# EAGLE design laser (EAGLE 6.5.0)
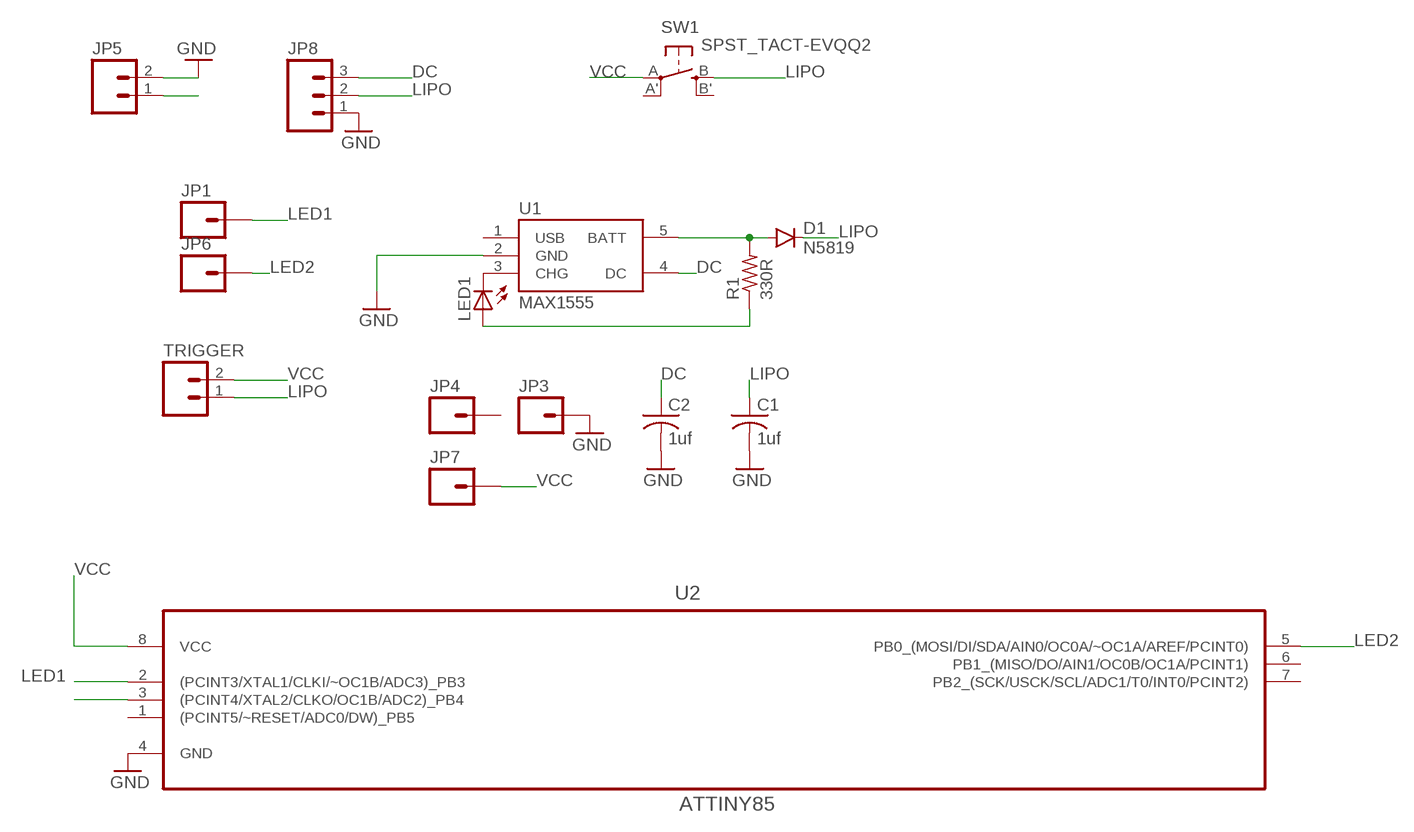
[diagram p0: schematic, sheet 1]

## Parts
C1  1uf  C-USC0805K  [C0805K]
C2  1uf  C-USC0805K  [C0805K]
D1  N5819  DIODE1N4148  [DIODE-1N4148]
JP1  M01PTH  [1X01]
JP3  M01PTH  [1X01]
JP4  M01PTH  [1X01]
JP5  M02LOCK  [1X02_LOCK]
JP6  M01PTH  [1X01]
JP7  M01PTH  [1X01]
JP8  M03LOCK  [1X03_LOCK]
LED1  LEDCHIP-LED0805  [CHIP-LED0805]
R1  330R  R-US_M0805  [M0805]
SW1  SPST_TACT-EVQQ2  [EVQ-Q2]
TRIGGER  M02PTH  [1X02]
U1  MAX1555  [SOT23-5]
U2  ATTINY85  ATTINY85-20PU  [DIP254P762X533-8]

## Nets
DC: C2.1 JP8.3 U1.4(DC)
GND: C1.2 C2.2 JP3.1 JP5.2 JP8.1 U1.2(GND) U2.4(GND)
LED1: JP1.1 U2.2((PCINT3/XTAL1/CLKI/~OC1B/ADC3)_PB3)
LED2: JP6.1 U2.5(PB0_(MOSI/DI/SDA/AIN0/OC0A/~OC1A/AREF/PCINT0))
LIPO: C1.1 D1.C JP8.2 SW1.B(S) TRIGGER.1
N$1: LED1.C U1.3(CHG)
N$3: D1.A R1.2 U1.5(BATT)
N$4: LED1.A R1.1
TONE: JP5.1 U2.3((PCINT4/XTAL2/CLKO/OC1B/ADC2)_PB4)
VCC: JP7.1 SW1.A(P) TRIGGER.2 U2.8(VCC)
Unconnected: JP4.1 SW1.A'(P1) SW1.B'(S1) U1.1(USB) U2.1((PCINT5/~RESET/ADC0/DW)_PB5) U2.6(PB1_(MISO/DO/AIN1/OC0B/OC1A/PCINT1)) U2.7(PB2_(SCK/USCK/SCL/ADC1/T0/INT0/PCINT2))

## Library data of the parts
C1 C2 = adafruit:C-US: CAPACITOR, American symbol
D1 = SparkFun-DiscreteSemi:DIODE: Diode These are standard reverse protection diodes and small signal diodes. SMA package can handle up to about 1A. SOD-323 can handle about 200mA. What the SOD-323 package when ordering, there are some mfgs out there that are 5-pin packages.
JP1 JP3 JP4 JP6 JP7 = SparkFun-Connectors:M01: Header 1 Standard 1-pin 0.1" header. Use with straight break away headers (SKU : PRT-00116), right angle break away headers (PRT-00553), swiss pins (PRT-00743), machine pins (PRT-00117), and female headers (PRT-00115).
JP5 TRIGGER = SparkFun-Connectors:M02: Standard 2-pin 0.1" header. Use with - straight break away headers ( PRT-00116) - right angle break away headers (PRT-00553) - swiss pins (PRT-00743) - machine pins (PRT-00117) - female headers (PRT-00115) Molex polarized connector foot print use with: PRT-08233 with associated crimp pins and housings. 2.54_SCREWTERM for use with PRT-10571. 3.5mm Screw Terminal footprints for PRT-08084 5mm Screw Terminal footprints for use with PRT-08432
JP8 = SparkFun-Connectors:M03: Header 3 Standard 3-pin 0.1" header. Use with straight break away headers (SKU : PRT-00116), right angle break away headers (PRT-00553), swiss pins (PRT-00743), machine pins (PRT-00117), and female headers (PRT-00115). Molex polarized connector foot print use with SKU : PRT-08232 with associated crimp pins and housings.
LED1 = adafruit:LED: LED OSRAM: - CHIPLED LG R971, LG N971, LY N971, LG Q971, LY Q971, LO R971, LY R971 LH N974, LH R974 LS Q976, LO Q976, LY Q976 LO Q996 - Hyper CHIPLED LW Q18S LB Q993, LB Q99A, LB R99A - SideLED LS A670, LO A670, LY A670, LG A670, LP A670 LB A673, LV A673, LT A673, LW A673 LH A674 LY A675 LS A676, LA A676, LO A676, LY A676, LW A676 LS A679, LY A679, LG A679 - Hyper Micro SIDELED® LS Y876, LA Y876, LO Y876, LY Y876 LT Y87S - SmartLED LW L88C, LW L88S LB L89C, LB L89S, LG L890 LS L89K, LO L89K, LY L89K LS L896, LA L896, LO L896, LY L896 - TOPLED LS T670, LO T670, LY T670, LG T670, LP T670 LSG T670, LSP T670, LSY T670, LOP T670, LYG T670 LG T671, LOG T671, LSG T671 LB T673, LV T673, LT T673, LW T673 LH T674 LS T676, LA T676, LO T676, LY T676, LB T676, LH T676, LSB T676, LW T676 LB T67C, LV T67C, LT T67C, LS T67K, LO T67K, LY T67K, LW E67C LS E67B, LA E67B, LO E67B, LY E67B, LB E67C, LV E67C, LT E67C LW T67C LS T679, LY T679, LG T679 LS T770, LO T770, LY T770, LG T770, LP T770 LB T773, LV T773, LT T773, LW T773 LH T774 LS E675, LA E675, LY E675, LS T675 LS T776, LA T776, LO T776, LY T776, LB T776 LHGB T686 LT T68C, LB T68C - Hyper Mini TOPLED® LB M676 - Mini TOPLED Santana® LG M470 LS M47K, LO M47K, LY M47K Source: http://www.osram.convergy.de/
R1 = adafruit:R-US_: RESISTOR, American symbol
SW1 = adafruit:SPST_TACT: SMT 6mm switch, EVQQ2 series http://www.ladyada.net/library/eagle
U1 = SparkFun-PowerIC:MAX1555: MAX1555 Lithium Charger IC SOT-23 Lithium Polymer charging IC. Schematic element and footprint proven. Spark Fun Electronics SKU : COM-00674
U2 = attiny85-dip-8:ATTINY85-20PU: 8-bit Microcontroller with In-System Programmable Flash; MPN: ATTINY85-20PU; OC_FARNELL: 1455162; OC_NEWARK: 58M3796; PACKAGE: PDIP-8; SUPPLIER: Atmel

## Board
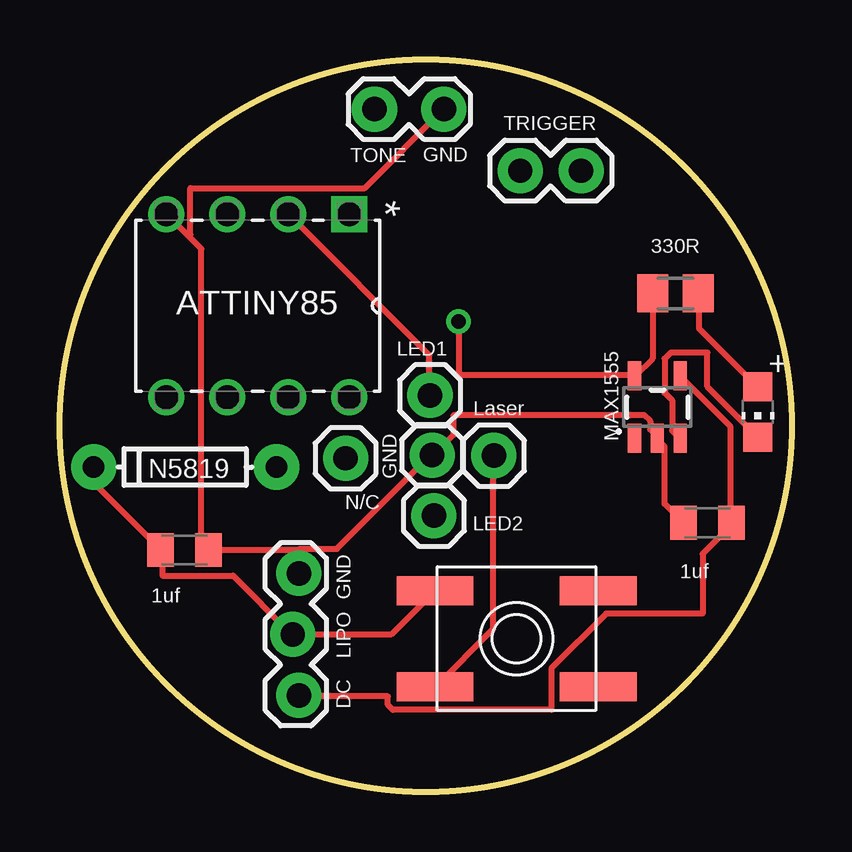
[diagram p1: board, top side]
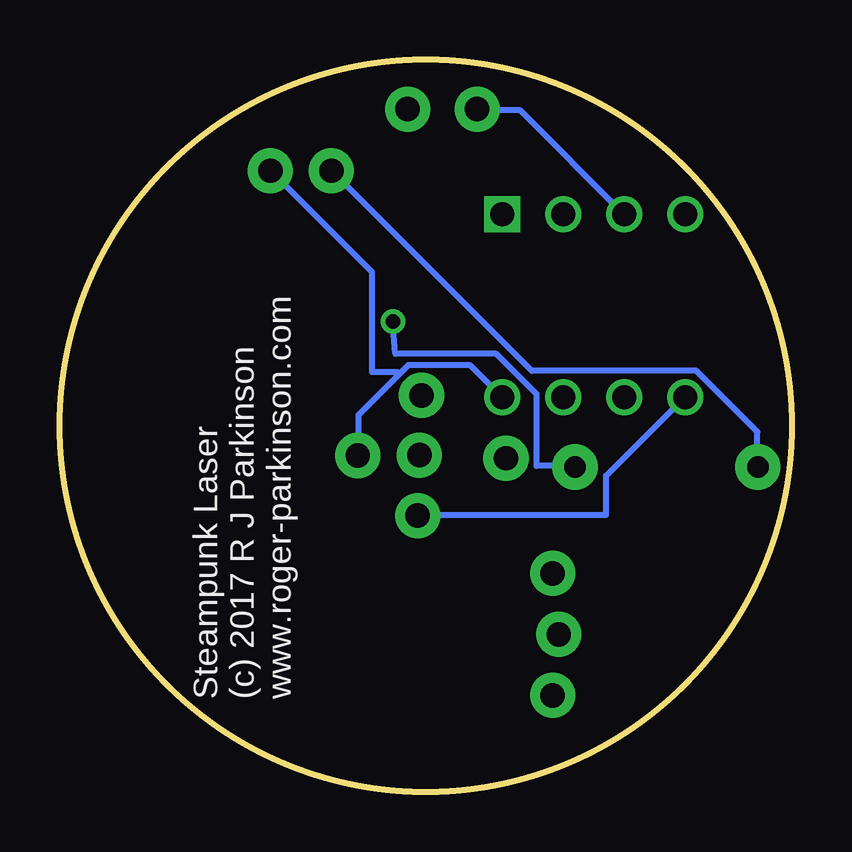
[diagram p2: board, bottom side, seen from below]

Size 30.48 x 30.48 mm. Coordinates in mm from the lower left corner, seen from the top.
Outline: circle at 15.24,15.24 radius 15.24
Copper layers (1*16): Top 0.035mm / dielectric 1.5mm / Bottom 0.035mm
Design rules "default": minimum track width 10mil, minimum drill 24mil, track to track 8mil, track to pad 8mil, pad to pad 8mil, via to via 8mil, smd to smd 8mil, copper to edge 40mil, drill to drill 8mil, minimum pad ring 10mil, minimum via ring 8mil, stop-mask expansion 4mil, vias tented up to drill 0mil, thermal gap 10mil

### Footprints (pad centres in the part's own frame; a part is rotated, then mirrored left to right if it is on the bottom)
C0805K = smd 1.1 x 1.4: 1 -1,0; 2 1,0
DIODE-1N4148 = drill 0.9 pad 1.88: A -3.81,0; C 3.81,0
1X01 = drill 1.016 pad 1.88: 1 0,0
1X02_LOCK = drill 1.016 pad 1.88: 1 -0.178,0; 2 2.718,0
1X03_LOCK = drill 1.016 pad 1.88: 1 0,0.127; 2 2.54,-0.127; 3 5.08,0.127
CHIP-LED0805 = smd 1.2 x 1.2: A 0,-1.05; C 0,1.05
M0805 = smd 1.3 x 1.6: 1 -0.95,0; 2 0.95,0
EVQ-Q2 = smd 3.2 x 1.2: A -3.4,-2; A' 3.4,-2; B -3.4,2; B' 3.4,2
1X02 = drill 1.016 pad 1.88: 1 0,0; 2 2.54,0
SOT23-5 = smd 0.55 x 1.2: 1 -0.95,-1.3; 2 0,-1.3; 3 0.95,-1.3; 4 0.95,1.3; 5 -0.95,1.3
DIP254P762X533-8 = drill 0.991 square: 1 -7.62,7.62 | drill 0.991: 2 -7.62,5.08; 3 -7.62,2.54; 4 -7.62,0; 5 0,0; 6 0,2.54; 7 0,5.08; 8 0,7.62

### Placement (x,y rotation side)
C1  5.18,10.06 0 top
C2  26.98,11.2 180 top
D1  5.21,13.52 180 top
JP1  15.42,16.51 0 top
JP3  15.5,14.01 90 top
JP4  11.9,13.88 0 top
JP5  13.28,28.44 0 top
JP6  15.58,11.49 0 top
JP7  18.08,14 0 top
JP8  9.83,9.09 270 top
LED1  29.08,15.81 180 top
R1  25.65,20.76 180 top
SW1  19.02,6.37 0 top
TRIGGER  19.18,25.87 0 top
U1  24.89,16.02 0 top
U2  4.43,16.43 270 top

### Tracks (layer width: path | path; a pad name or v marks a point on that pad's centre or on a via)
DC
  Top 0.254: U1.4 25.86,17.27 27.94,15.19 27.94,11.23 C2.1 27.94,11.07 26.77,9.91 26.77,7.42 22.76,7.42 20.47,5.13 20.47,3.4 13.87,3.4 13.66,3.61 13.66,3.96 9.96,3.96 JP8.3
GND
  Top 0.254: C2.2 25.96,11.23 25.2,11.99 25.2,14.38 24.89,14.68 U1.2 24.84,14.83 24.59,15.09 24.59,15.44 24.33,15.7 16.41,15.7 16.41,14.88 15.55,14.02 JP3.1 15.39,13.97 11.53,10.11 10.01,10.11 9.91,10.06 | 9.91,10.06 6.2,10.06 C1.2 6.15,10.16 5.89,10.41 5.89,22.61 5.36,23.14 | 9.91,10.06 9.91,9.09 JP8.1 | 5.36,23.14 4.47,24.03 U2.4 | JP5.2 15.95,28.4 12.7,25.15 5.44,25.15 5.44,23.22 5.36,23.14
LED1
  Top 0.254: U2.2 9.55,24.03 15.39,18.19 15.39,16.51 JP1.1
LED2
  Bottom 0.254: U2.5 4.47,16.41 7.72,13.16 7.72,11.53 15.55,11.53 JP6.1
LIPO
  Top 0.254: SW1.B 15.6,8.33 13.82,6.55 JP8.2 9.6,6.6 7.21,8.99 4.27,8.99 4.27,9.96 C1.1 4.17,10.11 1.52,12.75 1.52,13.41 1.42,13.51 D1.C
  Bottom 0.254: TRIGGER.1 19.15,25.86 10.82,17.53 3.96,17.53 1.42,14.99 1.42,13.56 D1.C
N$1
  Top 0.254: U1.3 25.81,14.73 25.5,15.04 25.5,16.31 25.2,16.61 25.2,18.03 25.45,18.29 26.98,18.29 26.98,16.87 29.06,14.78 LED1.C
N$3  (via drill 0.61)
  Top 0.254: R1.2 24.69,20.73 24.69,18.03 23.98,17.32 U1.5 23.83,17.37 16.61,17.37 v16.61,19.59
  Bottom 0.254: v16.61,19.59 16.51,18.24 12.29,18.24 10.62,16.56 10.62,13.56 9.04,13.56 D1.A
N$4
  Top 0.254: LED1.A 29.06,16.87 26.62,19.3 26.62,20.73 R1.1
TONE
  Bottom 0.254: U2.3 7.01,24.08 11.33,28.4 13.06,28.4 JP5.1
VCC
  Top 0.254: SW1.A 15.65,4.37 18.03,6.76 18.03,13.97 JP7.1
  Bottom 0.254: 16.33,17.4 18.03,15.7 18.03,14.02 JP7.1 | 16.33,17.4 15.95,17.78 13.41,17.78 12.09,16.46 U2.8 | TRIGGER.2 21.69,25.86 17.48,21.64 17.48,17.48 16.41,17.48 16.33,17.4

### Text on the board
tNames: TONE | GND | LED1 | Laser | GND | N/C | LED2 | GND | LIPO | DC
_bsilk: Steampunk Laser / (c) 2017 R J Parkinson / www.roger-parkinson.com